# Altium project Test Project.PrjPcb
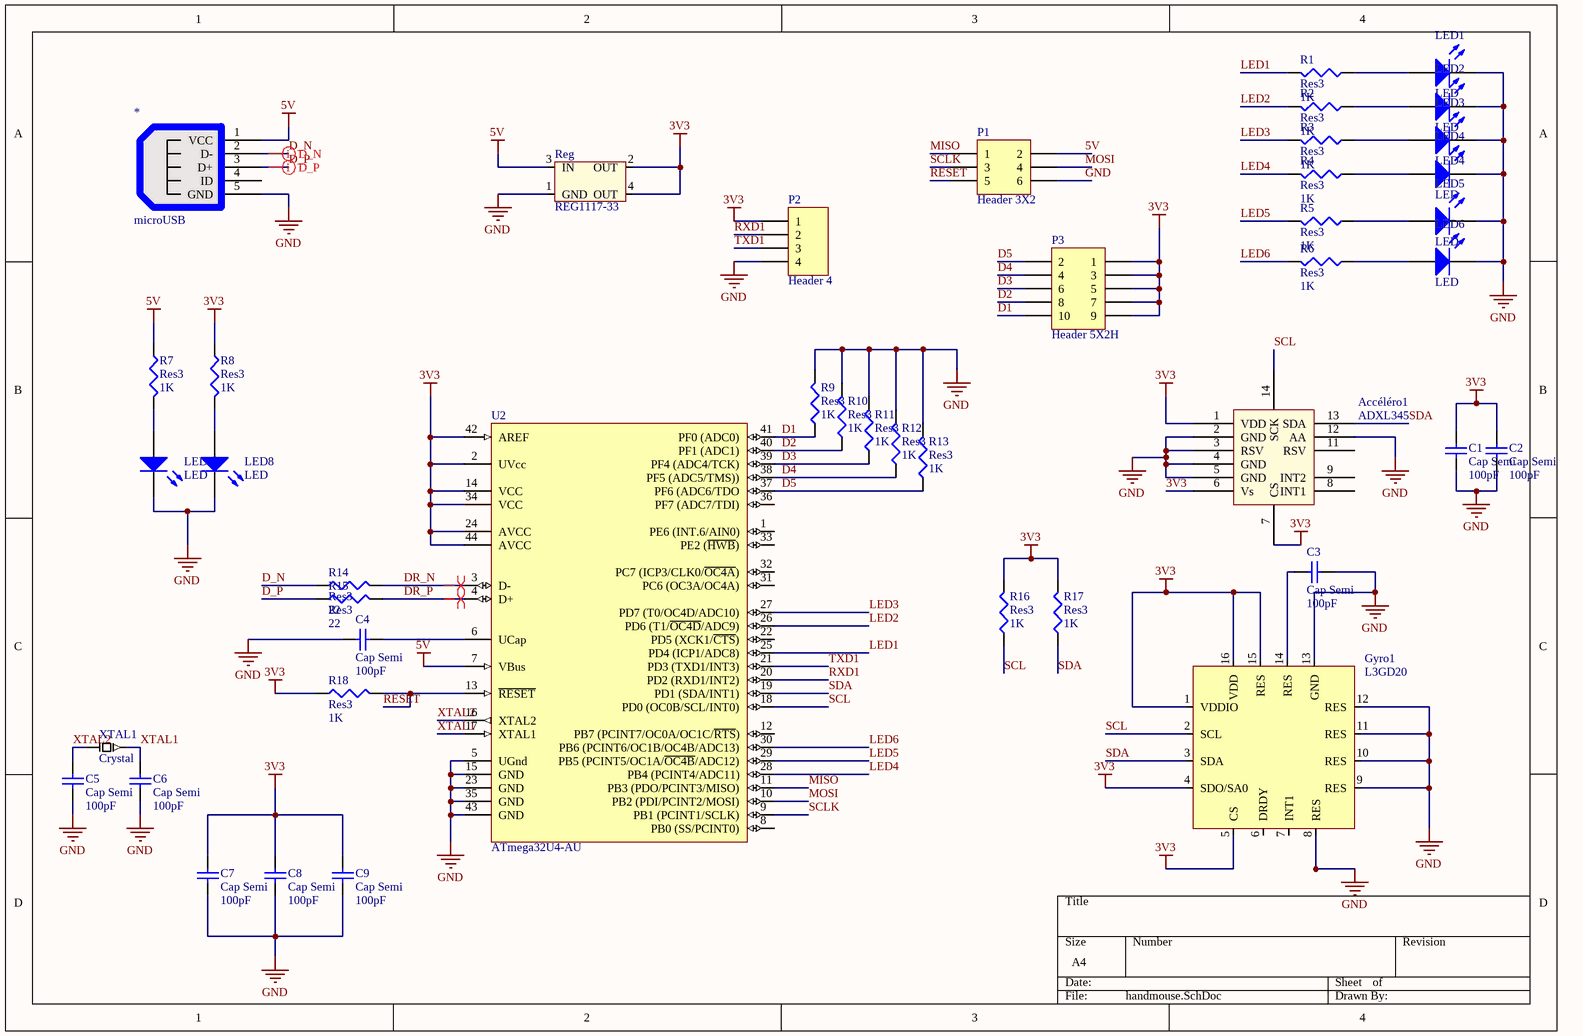
[diagram p0: handmouse.SchDoc]
1 sheet, 44 parts. Net scope: global (net labels, ports and power ports of the same name join across sheets).
Board file: PCB1.PcbDoc

## Sheet handmouse.SchDoc
size A4

### Parts
*  microUSB  [microUSB]
Accéléro1  ADXL345  [LGA-14]
C1  Cap Semi  value 100pF  [1608[0603]]
C2  Cap Semi  value 100pF  [1608[0603]]
C3  Cap Semi  value 100pF  [1608[0603]]
C4  Cap Semi  value 100pF  [1608[0603]]
C5  Cap Semi  value 100pF  [1608[0603]]
C6  Cap Semi  value 100pF  [1608[0603]]
C7  Cap Semi  value 100pF  [1608[0603]]
C8  Cap Semi  value 100pF  [1608[0603]]
C9  Cap Semi  value 100pF  [1608[0603]]
Gyro1  L3GD20  [QFN16]
LED1  LED  [LED 0603]
LED2  LED  [LED 0603]
LED3  LED4  [LED 0603]
LED4  LED  [LED 0603]
LED5  LED  [LED 0603]
LED6  LED  [LED 0603]
LED7  LED  [LED 0603]
LED8  LED  [LED 0603]
P1  Header 3X2  [HDR2X3]
P2  Header 4  [HDR1X4]
P3  Header 5X2H  [HDR2X5H]
R1  Res3  value 1K  [J1-0603]
R2  Res3  value 1K  [J1-0603]
R3  Res3  value 1K  [J1-0603]
R4  Res3  value 1K  [J1-0603]
R5  Res3  value 1K  [J1-0603]
R6  Res3  value 1K  [J1-0603]
R7  Res3  value 1K  [J1-0603]
R8  Res3  value 1K  [J1-0603]
R9  Res3  value 1K  [J1-0603]
R10  Res3  value 1K  [J1-0603]
R11  Res3  value 1K  [J1-0603]
R12  Res3  value 1K  [J1-0603]
R13  Res3  value 1K  [J1-0603]
R14  Res3  value 22  [J1-0603]
R15  Res3  value 22  [J1-0603]
R16  Res3  value 1K  [J1-0603]
R17  Res3  value 1K  [J1-0603]
R18  Res3  value 1K  [J1-0603]
Reg  REG1117-33  [SOT-223]
U2  ATmega32U4-AU  [44ML_N]
XTAL1  Crystal  [HC49-CMS]

### Nets
3V3: Accéléro1.1(VDD) Accéléro1.6(Vs) Accéléro1.7(CS) C1.2 C2.2 C7.2 C8.2 C9.2 Gyro1.1(VDDIO) Gyro1.4(SDO/SA0) Gyro1.5(CS) Gyro1.15(RES) Gyro1.16(VDD) P2.1 P3.1 P3.3 P3.5 P3.7 P3.9 R8.1 R16.2 R17.2 R18.1 Reg.2(OUT) Reg.4(OUT) U2.2(UVcc) U2.14(VCC) U2.24(AVCC) U2.34(VCC) U2.42(AREF) U2.44(AVCC)
5V: *.1(VCC) P1.2 R7.1 Reg.3(IN) U2.7(VBus)
GND: *.5(GND) Accéléro1.2(GND) Accéléro1.3(RSV) Accéléro1.4(GND) Accéléro1.5(GND) Accéléro1.12(AA) C1.1 C2.1 C3.1 C4.2 C5.1 C6.1 C7.1 C8.1 C9.1 Gyro1.8(RES) Gyro1.9(RES) Gyro1.10(RES) Gyro1.11(RES) Gyro1.12(RES) Gyro1.13(GND) LED1.2(K) LED2.2(K) LED3.2(K) LED4.2(K) LED5.2(K) LED6.2(K) LED7.2(K) LED8.2(K) P1.6 P2.4 R9.2 R10.2 R11.2 R12.2 R13.2 Reg.1(GND) U2.5(UGnd) U2.15(GND) U2.23(GND) U2.35(GND) U2.43(GND)
D1: P3.10 R9.1 U2.41(PF0_(ADC0))
D2: P3.8 R10.1 U2.40(PF1_(ADC1))
D3: P3.6 R11.1 U2.39(PF4_(ADC4/TCK))
D4: P3.4 R12.1 U2.38(PF5_(ADC5/TMS)))
D5: P3.2 R13.1 U2.37(PF6_(ADC6/TDO)
D_N: *.2(D-) R14.1
D_P: *.3(D+) R15.1
DR_N: R14.2 U2.3(D-)
DR_P: R15.2 U2.4(D+)
LED1: R1.2 U2.25(PD4_(ICP1/ADC8))
LED2: R2.2 U2.26(PD6_(T1/~{OC4D}/ADC9))
LED3: R3.2 U2.27(PD7_(T0/OC4D/ADC10))
LED4: R4.2 U2.28(PB4_(PCINT4/ADC11))
LED5: R5.2 U2.29(PB5_(PCINT5/OC1A/~{OC4B}/ADC12))
LED6: R6.2 U2.30(PB6_(PCINT6/OC1B/OC4B/ADC13))
MISO: P1.1 U2.11(PB3_(PDO/PCINT3/MISO))
MOSI: P1.4 U2.10(PB2_(PDI/PCINT2/MOSI))
RESET: P1.5 R18.2 U2.13(~{RESET})
RXD1: P2.2 U2.20(PD2_(RXD1/INT2))
SCL: Accéléro1.14(SCK) Gyro1.2(SCL) R16.1 U2.18(PD0_(OC0B/SCL/INT0))
SCLK: P1.3 U2.9(PB1_(PCINT1/SCLK))
SDA: Accéléro1.13(SDA) Gyro1.3(SDA) R17.1 U2.19(PD1_(SDA/INT1))
TXD1: P2.3 U2.21(PD3_(TXD1/INT3))
XTAL1: C6.2 U2.17(XTAL1) XTAL1.2
XTAL2: C5.2 U2.16(XTAL2) XTAL1.1
NetC3_2: C3.2 Gyro1.14(RES)
NetC4_1: C4.1 U2.6(UCap)
NetLED1_1: LED1.1(A) R1.1
NetLED2_1: LED2.1(A) R2.1
NetLED3_1: LED3.1(A) R3.1
NetLED4_1: LED4.1(A) R4.1
NetLED5_1: LED5.1(A) R5.1
NetLED6_1: LED6.1(A) R6.1
NetLED7_1: LED7.1(A) R7.2
NetLED8_1: LED8.1(A) R8.2

Not connected (* = marked no-connect by the designer): * 4(ID); Accéléro1 8(INT1) 9(INT2) 10(NC) 11(RSV); Gyro1 6(DRDY) 7(INT1); U2 1(PE6_(INT.6/AIN0)) 8(PB0_(SS/PCINT0)) 12(PB7_(PCINT7/OC0A/OC1C/~{RTS})) 22(PD5_(XCK1/~{CTS})) 31(PC6_(OC3A/OC4A)) 32(PC7_(ICP3/CLK0/~{OC4A})) 33(PE2_(~{HWB})) 36(PF7_(ADC7/TDI))

### Layout directives
differential pair: D_N, D_P, DR_N, DR_P

### Library data of the parts
* = microUSB: Fabricant: FCI; Ref Fabricant: 10103594-0001LF; RS: *; Farnell: 2300437; Mouser: *; Link: http://fr.farnell.com/hirose-hrs/zx62d-b-5p8/connecteur-micro-usb-femelle-5/dp/2300437
C1-C9 = Cap Semi: Capacitor (Semiconductor SIM Model); Published: 8-Jun-2000; LatestRevisionDate: 29-May-2009; LatestRevisionNote: IPC-7351 Footprint Added.; PackageReference: C1206; Publisher: Altium Limited; PackageDescription: Chip Capacitor
LED1-LED8 = LED: Fabricant: VISHAY; Ref Fabricant: VLMB1300-GS08; Farnell: 2251459; RS: *; Mouser: *; Link: http://fr.farnell.com/vishay/vlmb1300-gs08/led-0603-bleu-hautebrillant/dp/2251459
P1 = Header 3X2: Header, 3-Pin, Dual row; LatestRevisionDate: 17-Jul-2002; LatestRevisionNote: Re-released for DXP Platform.; Publisher: Altium Limited
P2 = Header 4: Header, 4-Pin; LatestRevisionDate: 17-Jul-2002; LatestRevisionNote: Re-released for DXP Platform.; Publisher: Altium Limited
P3 = Header 5X2H: Header, 5-Pin, Dual row, Right Angle; LatestRevisionDate: 17-Jul-2002; LatestRevisionNote: Re-released for DXP Platform.; Publisher: Altium Limited
R1-R18 = Res3: Resistor; Published: 8-Jun-2000; LatestRevisionDate: 29-May-2009; LatestRevisionNote: IPC-7351 Footprint Added.; PackageReference: J1-0603; Publisher: Altium Limited; PackageDescription: Chip Resistor
  R7 R8: Farnell: 2333561
U2 = ATmega32U4-AU: 8-bit AVR Microcontroller, 2.7-5.5V, 32KB Flash, 2.5KB EEPROM, 1KB SRAM, USB Controller, 44-pin TQFP, Industrial Grade (-40°C to 85°C); Farnel: 1748525; Published: 1-Apr-2010; DatasheetVersion: revD, Jan-2009; PackageVersion: rev.G, Jul-2007; PackageReference: 44ML; Publisher: Altium Limited; PackageDescription: 44-Pin Plastic Thin Quad Flat Pack, 10 x 10 x 1.0 mm Body, 0.8 mm Pitch (TQFP); Supplier 1: Digi-Key; Supplier Part Number 1: ATMEGA32U4-AU-ND; Supplier 2: Farnell; Supplier 3: Mouser; Mouser: 556-ATMEGA32U4-AU; ComponentLink1Description: Manufacturer Link; ComponentLink1URL: http://www.atmel.com/products/avr/default.asp?; ComponentLink2Description: ATmega16U4/32U4 Datasheet; ComponentLink2URL: http://www.atmel.com/dyn/resources/prod_documents/doc7766.pdf; ComponentLink3Description: ATmega16U4 ATmega32U4 Summary; ComponentLink3URL: http://www.atmel.com/dyn/resources/prod_documents/7766S.pdf; ComponentLink4Description: Atmel.com Home; ComponentLink4URL: http://www.atmel.com
Accéléro1 = ADXL345: Link: *; Ref Fabricant: *; Farnell: *; Mouser: *; RS: *; Fabricant: *
Gyro1 = L3GD20: RS: *; Farnell: *; Mouser: *; Link: *; Fabricant: *; Ref Fabricant: *
Reg = REG1117-33: Farnell: *; RS: *; Mouser: *; Fabricant: *; Link: *; Ref Fabricant: *
XTAL1 = Crystal: Farnell: *; Mouser: *; RS: *; Fabricant: *; Ref Fabricant: *; Link: *